# EAGLE design control_board (EAGLE 7.5.0)
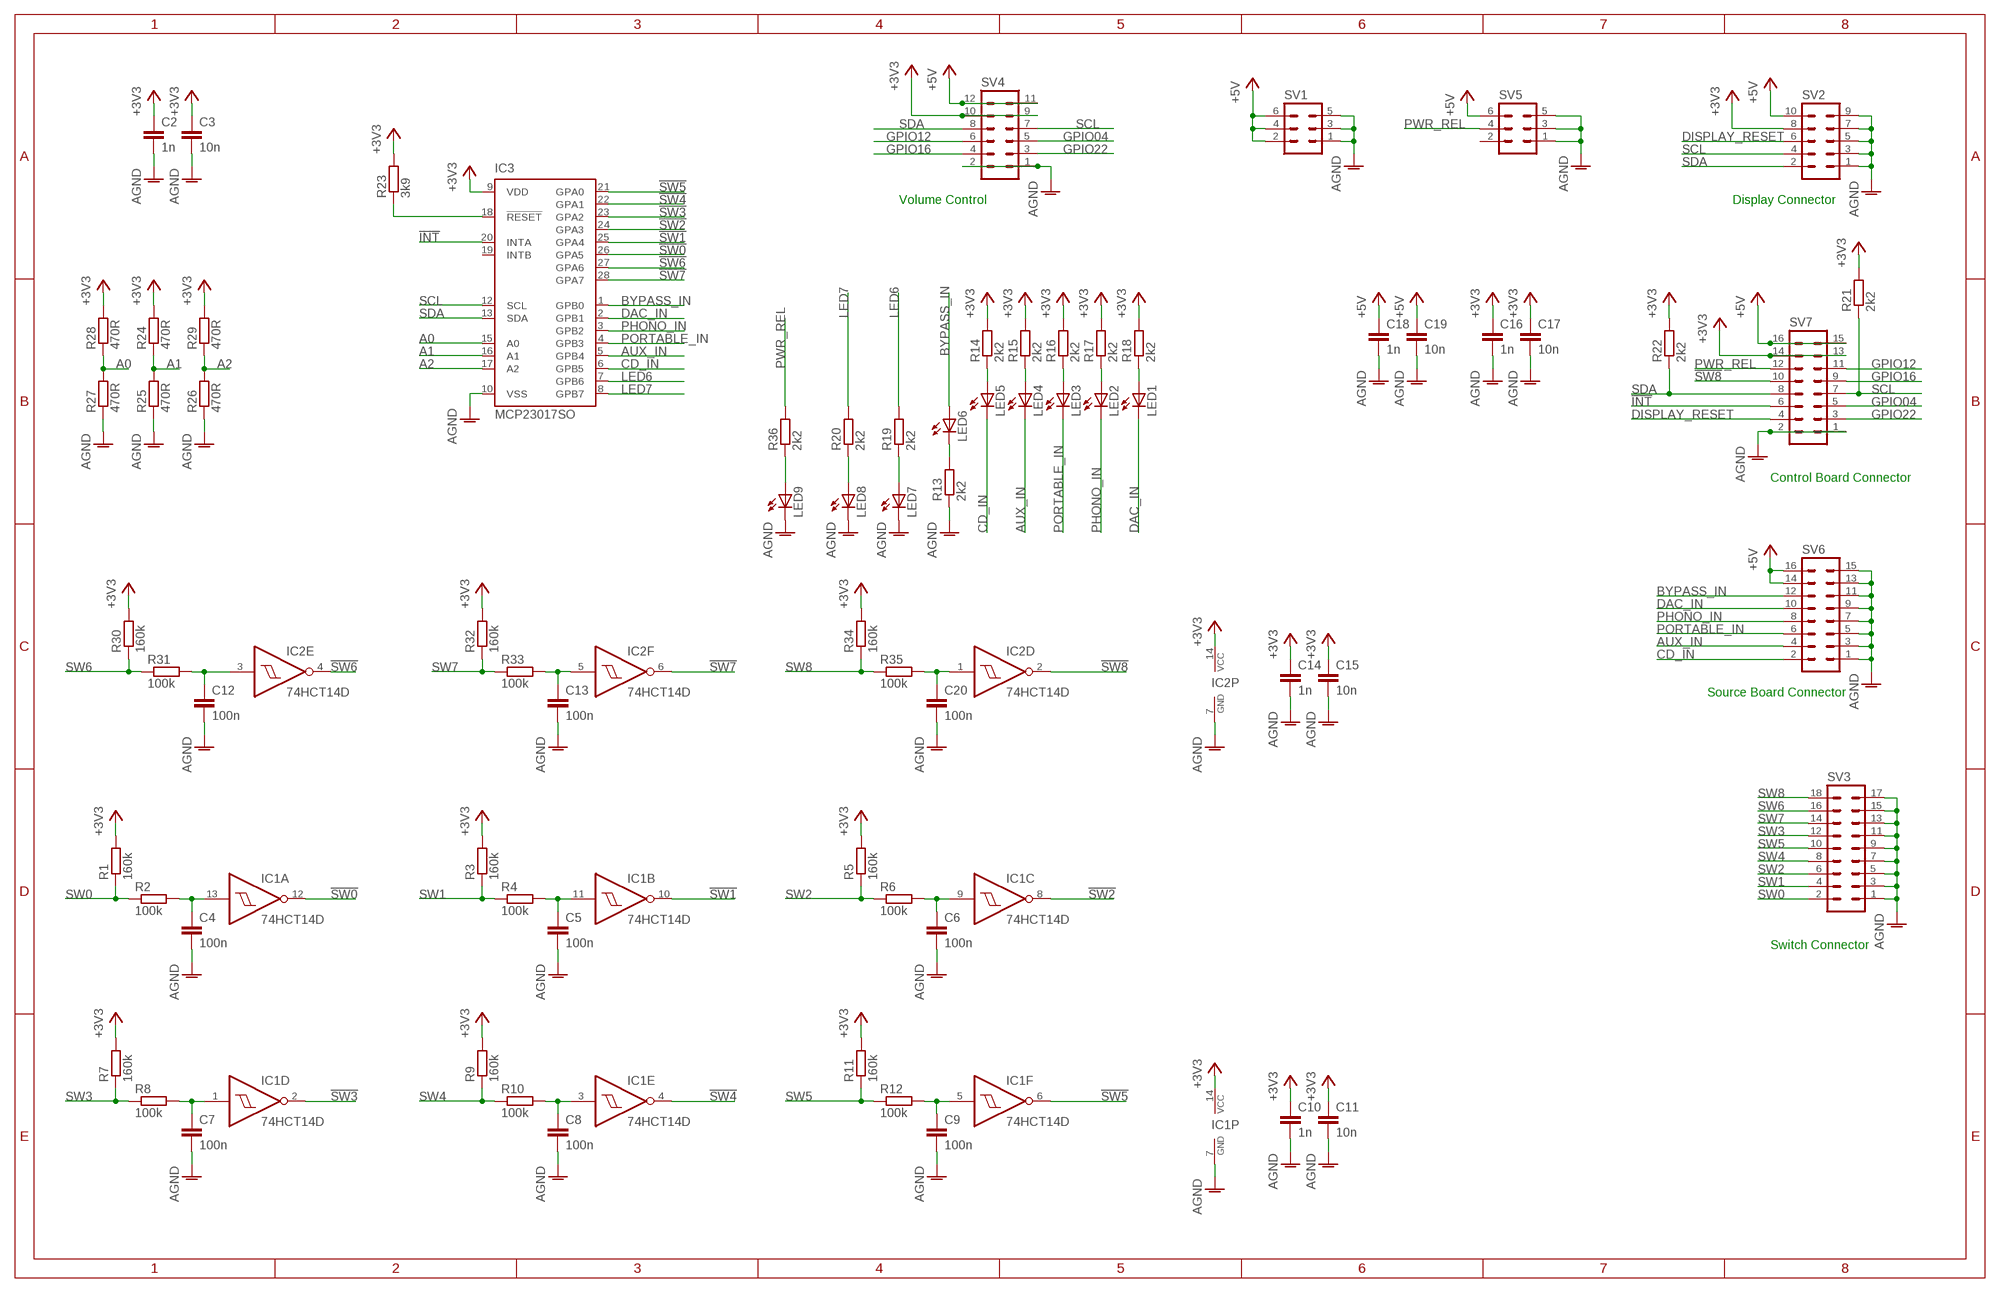
[diagram p0: schematic, sheet 1]

## Parts
C2  1n  C-EUC0603  [C0603]
C3  10n  C-EUC0603  [C0603]
C4  100n  C-EUC0603  [C0603]
C5  100n  C-EUC0603  [C0603]
C6  100n  C-EUC0603  [C0603]
C7  100n  C-EUC0603  [C0603]
C8  100n  C-EUC0603  [C0603]
C9  100n  C-EUC0603  [C0603]
C10  1n  C-EUC0603  [C0603]
C11  10n  C-EUC0603  [C0603]
C12  100n  C-EUC0603  [C0603]
C13  100n  C-EUC0603  [C0603]
C14  1n  C-EUC0603  [C0603]
C15  10n  C-EUC0603  [C0603]
C16  1n  C-EUC0603  [C0603]
C17  10n  C-EUC0603  [C0603]
C18  1n  C-EUC0603  [C0603]
C19  10n  C-EUC0603  [C0603]
C20  100n  C-EUC0603  [C0603]
IC1  74HCT14D  [SO14]
IC2  74HCT14D  [SO14]
IC3  MCP23017SO  [SO28W]
LED1  LEDCHIPLED_0603  [CHIPLED_0603]
LED2  LEDCHIPLED_0603  [CHIPLED_0603]
LED3  LEDCHIPLED_0603  [CHIPLED_0603]
LED4  LEDCHIPLED_0603  [CHIPLED_0603]
LED5  LEDCHIPLED_0603  [CHIPLED_0603]
LED6  LEDCHIPLED_0603  [CHIPLED_0603]
LED7  LEDCHIPLED_0603  [CHIPLED_0603]
LED8  LEDCHIPLED_0603  [CHIPLED_0603]
LED9  LEDCHIPLED_0603  [CHIPLED_0603]
R1  160k  R-EU_R0603  [R0603]
R2  100k  R-EU_R0603  [R0603]
R3  160k  R-EU_R0603  [R0603]
R4  100k  R-EU_R0603  [R0603]
R5  160k  R-EU_R0603  [R0603]
R6  100k  R-EU_R0603  [R0603]
R7  160k  R-EU_R0603  [R0603]
R8  100k  R-EU_R0603  [R0603]
R9  160k  R-EU_R0603  [R0603]
R10  100k  R-EU_R0603  [R0603]
R11  160k  R-EU_R0603  [R0603]
R12  100k  R-EU_R0603  [R0603]
R13  2k2  R-EU_R0603  [R0603]
R14  2k2  R-EU_R0603  [R0603]
R15  2k2  R-EU_R0603  [R0603]
R16  2k2  R-EU_R0603  [R0603]
R17  2k2  R-EU_R0603  [R0603]
R18  2k2  R-EU_R0603  [R0603]
R19  2k2  R-EU_R0603  [R0603]
R20  2k2  R-EU_R0603  [R0603]
R21  2k2  R-EU_R0603  [R0603]
R22  2k2  R-EU_R0603  [R0603]
R23  3k9  R-EU_R0603  [R0603]
R24  470R  R-EU_R0603  [R0603]
R25  470R  R-EU_R0603  [R0603]
R26  470R  R-EU_R0603  [R0603]
R27  470R  R-EU_R0603  [R0603]
R28  470R  R-EU_R0603  [R0603]
R29  470R  R-EU_R0603  [R0603]
R30  160k  R-EU_R0603  [R0603]
R31  100k  R-EU_R0603  [R0603]
R32  160k  R-EU_R0603  [R0603]
R33  100k  R-EU_R0603  [R0603]
R34  160k  R-EU_R0603  [R0603]
R35  100k  R-EU_R0603  [R0603]
R36  2k2  R-EU_R0603  [R0603]
SV1  MA03-2  [MA03-2]
SV2  MA05-2  [MA05-2]
SV3  MA09-2  [MA09-2]
SV4  MA06-2  [MA06-2]
SV5  MA03-2  [MA03-2]
SV6  MA08-2  [MA08-2]
SV7  MA08-2  [MA08-2]

## Nets
!INT: IC3.20(INTA) SV7.6
!SW0: IC1.12(A:O) IC3.26(GPA5)
!SW1: IC1.10(B:O) IC3.25(GPA4)
!SW2: IC1.8(C:O) IC3.24(GPA3)
!SW3: IC1.2(D:O) IC3.23(GPA2)
!SW4: IC1.4(E:O) IC3.22(GPA1)
!SW5: IC1.6(F:O) IC3.21(GPA0)
!SW6: IC2.4(E:O) IC3.27(GPA6)
!SW7: IC2.6(F:O) IC3.28(GPA7)
!SW8: IC2.2(D:O) SV7.10
+3V3: C2.1 C3.1 C10.1 C11.1 C14.1 C15.1 C16.1 C17.1 IC1.14(P:VCC) IC2.14(P:VCC) IC3.9(VDD) R1.2 R3.2 R5.2 R7.2 R9.2 R11.2 R14.2 R15.2 R16.2 R17.2 R18.2 R21.2 R22.2 R23.2 R24.2 R28.2 R29.2 R30.2 R32.2 R34.2 SV2.8 SV4.9 SV4.10 SV7.13 SV7.14
+5V: C18.1 C19.1 SV1.2 SV1.4 SV1.6 SV2.10 SV4.11 SV4.12 SV5.6 SV6.14 SV6.16 SV7.15 SV7.16
A0: IC3.15(A0) R27.2 R28.1
A1: IC3.16(A1) R24.1 R25.2
A2: IC3.17(A2) R26.2 R29.1
AGND: C2.2 C3.2 C4.2 C5.2 C6.2 C7.2 C8.2 C9.2 C10.2 C11.2 C12.2 C13.2 C14.2 C15.2 C16.2 C17.2 C18.2 C19.2 C20.2 IC1.7(P:GND) IC2.7(P:GND) IC3.10(VSS) LED7.C LED8.C LED9.C R13.1 R25.1 R26.1 R27.1 SV1.1 SV1.3 SV1.5 SV2.1 SV2.3 SV2.5 SV2.7 SV2.9 SV3.1 SV3.3 SV3.5 SV3.7 SV3.9 SV3.11 SV3.13 SV3.15 SV3.17 SV4.1 SV4.2 SV5.1 SV5.3 SV5.5 SV6.1 SV6.3 SV6.5 SV6.7 SV6.9 SV6.11 SV6.13 SV6.15 SV7.1 SV7.2
AUX_IN: IC3.5(GPB4) LED4.C SV6.4
BYPASS_IN: IC3.1(GPB0) LED6.A SV6.12
CD_IN: IC3.6(GPB5) LED5.C SV6.2
DAC_IN: IC3.2(GPB1) LED1.C SV6.10
DISPLAY_RESET: SV2.6 SV7.4
GPIO04: SV4.5 SV7.5
GPIO12: SV4.6 SV7.11
GPIO16: SV4.4 SV7.9
GPIO22: SV4.3 SV7.3
LED6: IC3.7(GPB6) R19.2
LED7: IC3.8(GPB7) R20.2
N$1: C20.1 IC2.1(D:I) R35.2
N$2: LED5.A R14.1
N$3: LED4.A R15.1
N$4: LED3.A R16.1
N$5: LED2.A R17.1
N$6: LED1.A R18.1
N$7: LED7.A R19.1
N$8: LED8.A R20.1
N$9: LED6.C R13.2
N$10: LED9.A R36.1
N$11: C12.1 IC2.3(E:I) R31.2
N$12: C4.1 IC1.13(A:I) R2.2
N$13: C13.1 IC2.5(F:I) R33.2
N$14: C5.1 IC1.11(B:I) R4.2
N$15: IC3.18(!RESET) R23.1
N$16: C6.1 IC1.9(C:I) R6.2
N$18: C7.1 IC1.1(D:I) R8.2
N$20: C8.1 IC1.3(E:I) R10.2
N$23: C9.1 IC1.5(F:I) R12.2
PHONO_IN: IC3.3(GPB2) LED2.C SV6.8
PORTABLE_IN: IC3.4(GPB3) LED3.C SV6.6
PWR_REL: R36.2 SV5.4 SV7.12
SCL: IC3.12(SCL) R21.1 SV2.4 SV4.7 SV7.7
SDA: IC3.13(SDA) R22.1 SV2.2 SV4.8 SV7.8
SW0: R1.1 R2.1 SV3.2
SW1: R3.1 R4.1 SV3.4
SW2: R5.1 R6.1 SV3.6
SW3: R7.1 R8.1 SV3.12
SW4: R9.1 R10.1 SV3.8
SW5: R11.1 R12.1 SV3.10
SW6: R30.1 R31.1 SV3.16
SW7: R32.1 R33.1 SV3.14
SW8: R34.1 R35.1 SV3.18
Unconnected: IC2.8(C:O) IC2.9(C:I) IC2.10(B:O) IC2.11(B:I) IC2.12(A:O) IC2.13(A:I) IC3.19(INTB) SV5.2

## Notes on the sheet
- Volume Control | Display Connector
- Control Board Connector
- Source Board Connector
- Switch Connector

## Library data of the parts
C2-C20 = rcl:C-EU: CAPACITOR, European symbol
IC1 IC2 = 74xx-eu:74*14: Hex schmitt trigger INVERTER
IC3 = microchip:MCP23017: http://ww1.microchip.com/downloads/en/DeviceDoc/21952a.pdf Source: http://ww1.microchip.com/downloads/en/DeviceDoc/21952a.pdf; MF: MICROCHIP; MPN: MCP23017-E/SO; OC_FARNELL: 1332087; OC_NEWARK: 31K2958
LED1-LED9 = led:LED: LED OSRAM: - CHIPLED LG R971, LG N971, LY N971, LG Q971, LY Q971, LO R971, LY R971 LH N974, LH R974 LS Q976, LO Q976, LY Q976 LO Q996 - Hyper CHIPLED LW Q18S LB Q993, LB Q99A, LB R99A - SideLED LS A670, LO A670, LY A670, LG A670, LP A670 LB A673, LV A673, LT A673, LW A673 LH A674 LY A675 LS A676, LA A676, LO A676, LY A676, LW A676 LS A679, LY A679, LG A679 - Hyper Micro SIDELED® LS Y876, LA Y876, LO Y876, LY Y876 LT Y87S - SmartLED LW L88C, LW L88S LB L89C, LB L89S, LG L890 LS L89K, LO L89K, LY L89K LS L896, LA L896, LO L896, LY L896 - TOPLED LS T670, LO T670, LY T670, LG T670, LP T670 LSG T670, LSP T670, LSY T670, LOP T670, LYG T670 LG T671, LOG T671, LSG T671 LB T673, LV T673, LT T673, LW T673 LH T674 LS T676, LA T676, LO T676, LY T676, LB T676, LH T676, LSB T676, LW T676 LB T67C, LV T67C, LT T67C, LS T67K, LO T67K, LY T67K, LW E67C LS E67B, LA E67B, LO E67B, LY E67B, LB E67C, LV E67C, LT E67C LW T67C LS T679, LY T679, LG T679 LS T770, LO T770, LY T770, LG T770, LP T770 LB T773, LV T773, LT T773, LW T773 LH T774 LS E675, LA E675, LY E675, LS T675 LS T776, LA T776, LO T776, LY T776, LB T776 LHGB T686 LT T68C, LB T68C - Hyper Mini TOPLED® LB M676 - Mini TOPLED Santana® LG M470 LS M47K, LO M47K, LY M47K Source: http://www.osram.convergy.de LUXEON: - LUMILED® LXK2-PW12-R00, LXK2-PW12-S00, LXK2-PW14-U00, LXK2-PW14-V00 LXK2-PM12-R00, LXK2-PM12-S00, LXK2-PM14-U00 LXK2-PE12-Q00, LXK2-PE12-R00, LXK2-PE12-S00, LXK2-PE14-T00, LXK2-PE14-U00 LXK2-PB12-K00, LXK2-PB12-L00, LXK2-PB12-M00, LXK2-PB14-N00, LXK2-PB14-P00, LXK2-PB14-Q00 LXK2-PR12-L00, LXK2-PR12-M00, LXK2-PR14-Q00, LXK2-PR14-R00 LXK2-PD12-Q00, LXK2-PD12-R00, LXK2-PD12-S00 LXK2-PH12-R00, LXK2-PH12-S00 LXK2-PL12-P00, LXK2-PL12-Q00, LXK2-PL12-R00 Source: www.luxeon.com KINGBRIGHT: KA-3528ASYC Source: www.kingbright.com
R1-R36 = rcl:R-EU_: RESISTOR, European symbol
SV1 SV5 = con-lstb:MA03-2: PIN HEADER; OC_FARNELL: unknown; OC_NEWARK: unknown
SV2 = con-lstb:MA05-2: PIN HEADER; OC_FARNELL: unknown; OC_NEWARK: unknown
SV3 = con-lstb:MA09-2: PIN HEADER; OC_FARNELL: unknown; OC_NEWARK: unknown
SV4 = con-lstb:MA06-2: PIN HEADER; OC_FARNELL: unknown; OC_NEWARK: unknown
SV6 SV7 = con-lstb:MA08-2: PIN HEADER; OC_FARNELL: unknown; OC_NEWARK: unknown

## Board
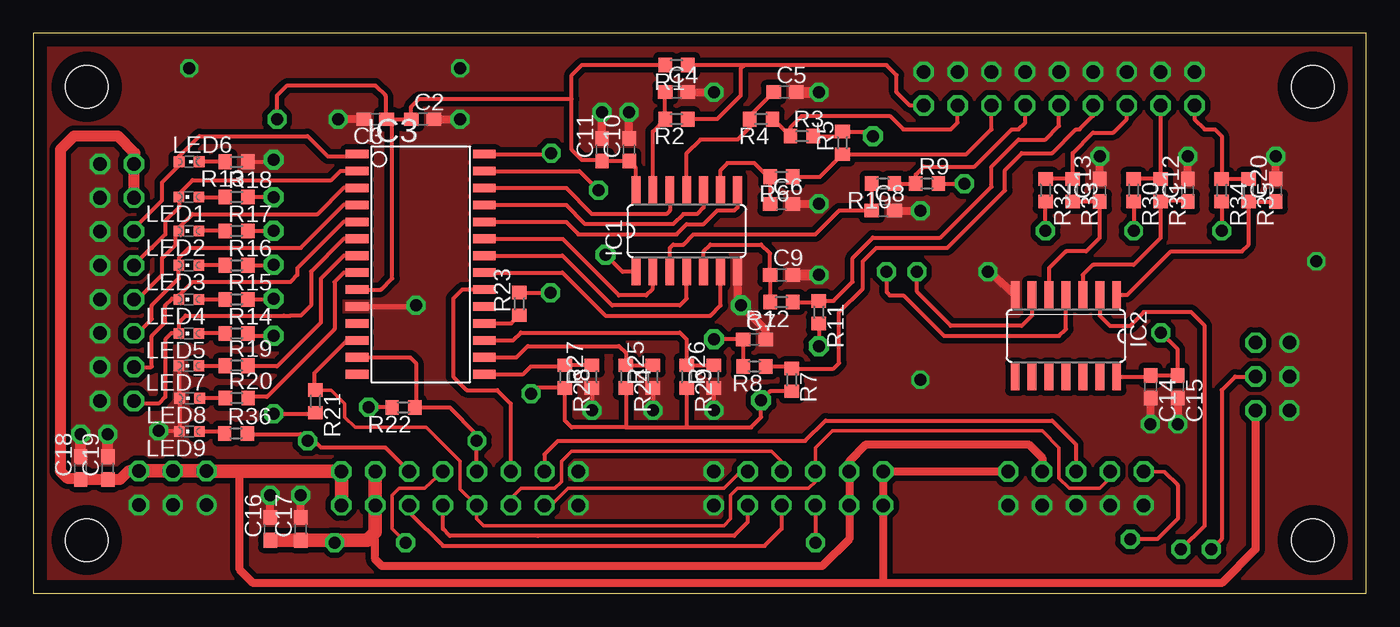
[diagram p1: board, top side]
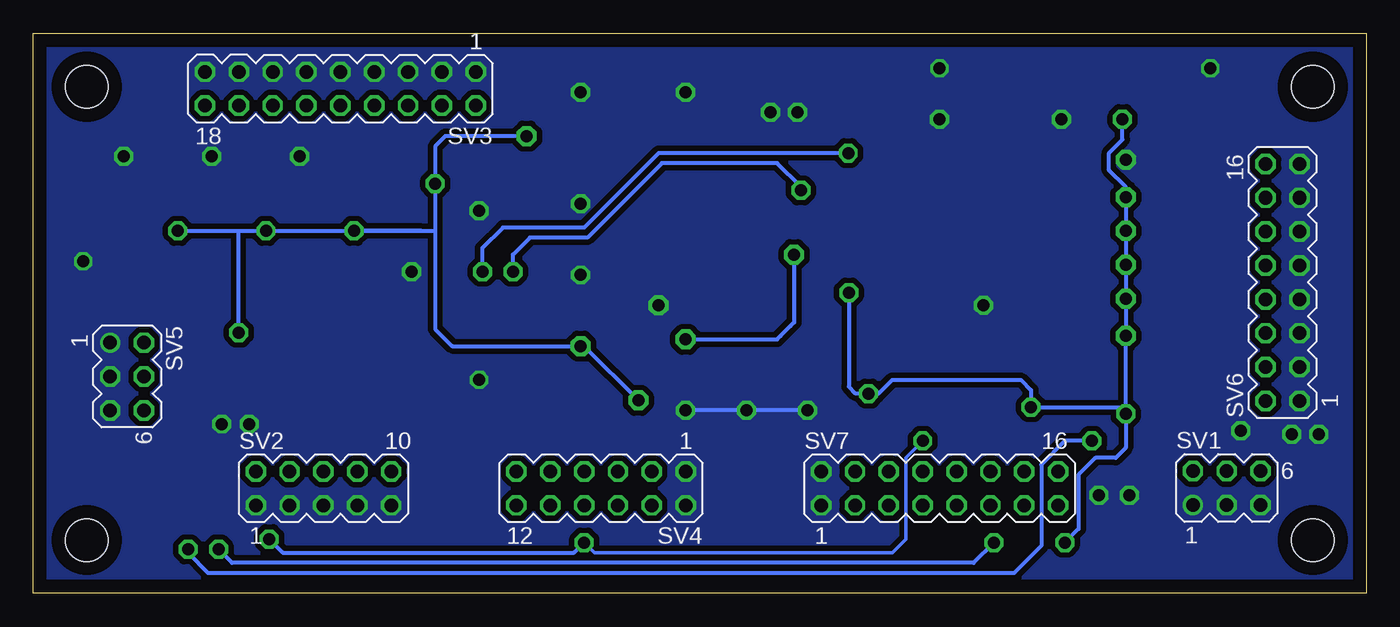
[diagram p2: board, bottom side, seen from below]

Size 100 x 42 mm. Coordinates in mm from the lower left corner, seen from the top.
Outline: 0,0 100,0 100,42 0,42 0,0
Copper layers (1*16): Top 0.035mm / dielectric 1.5mm / Bottom 0.035mm
Design rules "default": minimum track width 10mil, minimum drill 24mil, track to track 8mil, track to pad 8mil, pad to pad 8mil, via to via 8mil, smd to smd 8mil, copper to edge 40mil, drill to drill 8mil, minimum pad ring 10mil, minimum via ring 8mil, stop-mask expansion 4mil, vias tented up to drill 0mil, thermal gap 10mil
Holes 3.2 mm at 4,4 4,38 96,4 96,38

### Footprints (pad centres in the part's own frame; a part is rotated, then mirrored left to right if it is on the bottom)
C0603 = smd 1.1 x 1: 1 -0.85,0; 2 0.85,0
SO14 = smd 0.66 x 2.032: 1 -3.81,-3.073; 2 -2.54,-3.073; 3 -1.27,-3.073; 4 0,-3.073; 5 1.27,-3.073; 6 2.54,-3.073; 7 3.81,-3.073; 8 3.81,3.073; 9 2.54,3.073; 10 1.27,3.073; 11 0,3.073; 12 -1.27,3.073; 13 -2.54,3.073; 14 -3.81,3.073
SO28W = smd 0.65 x 1.7: 1 -7.62,-4.78; 2 -6.35,-4.78; 3 -5.08,-4.78; 4 -3.81,-4.78; 5 -2.54,-4.78; 6 -1.27,-4.78; 7 0,-4.78; 8 1.27,-4.78; 9 2.54,-4.78; 10 3.81,-4.78; 11 5.08,-4.78; 12 6.35,-4.78; 13 7.62,-4.78; 14 8.89,-4.78; 15 8.89,4.78; 16 7.62,4.78; 17 6.35,4.78; 18 5.08,4.78; 19 3.81,4.78; 20 2.54,4.78; 21 1.27,4.78; 22 0,4.78; 23 -1.27,4.78; 24 -2.54,4.78; 25 -3.81,4.78; 26 -5.08,4.78; 27 -6.35,4.78; 28 -7.62,4.78
CHIPLED_0603 = smd 0.8 x 0.8: A 0,-0.75; C 0,0.75
R0603 = smd 1 x 1.1: 1 -0.85,0; 2 0.85,0
MA03-2 = drill 1.016: 1 -2.54,-1.27 | drill 1.016 octagon: 2 -2.54,1.27; 3 0,-1.27; 4 0,1.27; 5 2.54,-1.27; 6 2.54,1.27
MA05-2 = drill 1.016 octagon: 1 -5.08,-1.27; 2 -5.08,1.27; 3 -2.54,-1.27; 4 -2.54,1.27; 5 0,-1.27; 6 0,1.27; 7 2.54,-1.27; 8 2.54,1.27; 9 5.08,-1.27; 10 5.08,1.27
MA09-2 = drill 1.016 octagon: 1 -10.16,-1.27; 2 -10.16,1.27; 3 -7.62,-1.27; 4 -7.62,1.27; 5 -5.08,-1.27; 6 -5.08,1.27; 7 -2.54,-1.27; 8 -2.54,1.27; 9 0,-1.27; 10 0,1.27; 11 2.54,-1.27; 12 2.54,1.27; 13 5.08,-1.27; 14 5.08,1.27; 15 7.62,-1.27; 16 7.62,1.27; 17 10.16,-1.27; 18 10.16,1.27
MA06-2 = drill 1.016 octagon: 1 -6.35,-1.27; 2 -6.35,1.27; 3 -3.81,-1.27; 4 -3.81,1.27; 5 -1.27,-1.27; 6 -1.27,1.27; 7 1.27,-1.27; 8 1.27,1.27; 9 3.81,-1.27; 10 3.81,1.27; 11 6.35,-1.27; 12 6.35,1.27
MA08-2 = drill 1.016 octagon: 1 -8.89,-1.27; 2 -8.89,1.27; 3 -6.35,-1.27; 4 -6.35,1.27; 5 -3.81,-1.27; 6 -3.81,1.27; 7 -1.27,-1.27; 8 -1.27,1.27; 9 1.27,-1.27; 10 1.27,1.27; 11 3.81,-1.27; 12 3.81,1.27; 13 6.35,-1.27; 14 6.35,1.27; 15 8.89,-1.27; 16 8.89,1.27

### Placement (x,y rotation side)
C2  29.21,35.56 0 top
C3  25.65,35.56 180 top
C4  48.26,37.59 0 top
C5  56.39,37.59 0 top
C6  56.13,29.21 0 top
C7  54.1,19.05 0 top
C8  63.75,28.7 0 top
C9  56.13,23.88 0 top
C10  44.7,33.27 90 top
C11  42.67,33.27 90 top
C12  86.61,30.23 90 top
C13  80.01,30.23 90 top
C14  83.82,15.49 270 top
C15  85.85,15.49 270 top
C16  17.78,4.83 90 top
C17  20.07,4.83 90 top
C18  3.56,9.4 90 top
C19  5.59,9.4 90 top
C20  93.22,30.23 90 top
IC1  49.02,27.18 0 top
IC2  77.47,19.3 180 top
IC3  29.07,25.32 270 top
LED1  11.68,29.73 90 top
LED2  11.68,27.18 90 top
LED3  11.68,24.61 90 top
LED4  11.68,22.05 90 top
LED5  11.68,19.49 90 top
LED6  11.69,32.37 270 top
LED7  11.68,17.07 90 top
LED8  11.73,14.63 90 top
LED9  11.71,12.14 90 top
R1  48.26,39.62 180 top
R2  48.26,35.56 180 top
R3  57.66,34.29 0 top
R4  54.61,35.56 180 top
R5  60.71,33.78 90 top
R6  56.13,31.24 180 top
R7  56.9,16 270 top
R8  54.1,17.02 180 top
R9  67.06,30.73 0 top
R10  63.75,30.73 180 top
R11  58.93,21.08 270 top
R12  56.13,21.84 180 top
R13  15.24,32.37 180 top
R14  15.24,19.49 0 top
R15  15.24,22.05 0 top
R16  15.24,24.61 0 top
R17  15.24,27.18 0 top
R18  15.24,29.73 0 top
R19  15.24,17.07 0 top
R20  15.27,14.64 0 top
R21  21.16,14.39 270 top
R22  27.76,13.94 180 top
R23  36.47,21.7 90 top
R24  44.45,16.26 270 top
R25  46.48,16.26 90 top
R26  51.05,16.26 90 top
R27  41.91,16.26 90 top
R28  39.88,16.26 270 top
R29  49.02,16.26 270 top
R30  82.55,30.23 270 top
R31  84.58,30.23 270 top
R32  75.95,30.23 270 top
R33  77.98,30.23 270 top
R34  89.15,30.23 270 top
R35  91.19,30.23 270 top
R36  15.21,11.99 0 top
SV1  10.46,7.91 0 bottom
SV2  78.23,7.87 0 bottom
SV3  76.96,37.85 180 bottom
SV4  57.4,7.87 180 bottom
SV5  92.96,16.26 270 bottom
SV6  6.27,23.32 90 bottom
SV7  32,7.87 0 bottom

### Tracks (layer width: path | path; a pad name or v marks a point on that pad's centre or on a via)
!INT
  Top 0.305: IC3.20 32.18,22.78 31.5,22.1 31.5,16.26 32.51,15.24 34.8,15.24 35.81,14.22 SV7.6
!SW0
  Top 0.305: IC1.12 47.75,28.7 47.5,28.45 41.91,28.45 39.96,30.4 IC3.26
!SW1
  Top 0.305: IC1.10 50.29,28.96 49.78,28.45 48.77,28.45 48.01,27.69 41.4,27.69 39.96,29.13 IC3.25
!SW2
  Top 0.305: IC1.8 52.83,28.96 52.58,28.7 51.31,28.7 50.29,27.69 49.02,27.69 48.26,26.92 40.89,26.92 39.96,27.86 IC3.24
!SW3
  Top 0.305: IC1.2 46.48,22.86 45.97,22.35 43.94,22.35 39.7,26.59 IC3.23
!SW4
  Top 0.305: IC1.4 49.02,22.1 48.51,21.59 43.43,21.59 39.7,25.32 IC3.22
!SW5
  Top 0.305: IC1.6 51.56,21.59 50.8,20.83 42.93,20.83 39.7,24.05 IC3.21
!SW6  (via drill 0.9 pad 1.42)
  Top 0.305: IC3.27 40.97,31.67 v42.42,30.23 | IC2.4 77.47,19.81 76.96,19.3 68.33,19.3 65.28,22.35 64.26,22.35 64.01,22.61 v64.01,24.13
  Bottom 0.305: v42.42,30.23 42.42,30.48 44.2,32.26 52.83,32.26 58.42,26.67 62.74,26.67 64.01,25.4 v64.01,24.13
!SW7  (via drill 0.9 pad 1.42)
  Top 0.305: IC3.28 38.78,32.94 v38.86,33.02 | v66.29,24.13 66.29,22.61 68.83,20.07 74.17,20.07 74.93,20.83 IC2.6
  Bottom 0.305: v38.86,33.02 53.09,33.02 58.67,27.43 64.77,27.43 66.29,25.91 v66.29,24.13
!SW8  (via drill 0.9 pad 1.42)
  Top 0.254: v27.94,3.81 26.92,4.83 26.92,7.37 27.43,7.87 29.34,7.87 SV7.10
  Top 0.305: IC2.2 80.01,20.83 80.77,20.07 82.3,20.07 83.31,21.08 86.87,21.08 87.88,20.07 87.88,5.08 v86.11,3.3
  Bottom 0.305: v27.94,3.81 29.46,2.29 85.09,2.29 v86.11,3.3
+3V3  (via drill 0.9 pad 1.42, 0.9 pad 1.5)
  Top 0.305: R15.2 17.99,22.05 v18.03,22.1 | R14.2 16.28,19.3 v18.03,19.3 | R16.2 18,24.61 v18.03,24.64 | R17.2 v18.03,27.18 | R18.2 18.02,29.73 v18.03,29.72 | C3.1 C2.1 28.36,36.49 28.96,37.08 40.39,37.08 | IC1.14 45.21,31.92 C10.1 C11.1 42.58,32.51 41.15,32.51 40.39,33.27 40.39,37.08 | IC3.9 26.08,22.78 26.92,23.62 26.92,35.14 C3.1 | R23.2 v38.81,22.55 38.86,22.61 | v18.03,13.46 21.09,13.46 R21.2 | 49.02,13.21 R29.2 49.02,12.45 | R24.2 44.45,12.45 | 44.45,12.45 40.39,12.45 39.88,12.95 R28.2 37.76,15.41 v37.34,14.99 | R22.2 25.18,13.94 v25.15,13.97 | 44.45,12.45 49.02,12.45 | 49.02,12.45 53.85,12.45 54.61,13.21 v54.61,14.48 55.28,15.15 R7.2 | v18.29,35.56 18.29,37.34 19.05,38.1 25.65,38.1 26.42,37.34 26.42,35.65 C3.1 | R1.2 41.15,39.62 40.39,38.86 40.39,37.08 | R3.2 60.36,34.29 R5.2 62.65,34.63 v62.99,34.29 | R9.2 v69.85,30.73 | R11.2 v58.93,18.54 | v75.95,27.18 R32.2 | R30.2 v82.55,27.18 | R34.2 v89.15,27.18 | IC2.14 83.71,16.23 C14.1 C15.1 85.85,18.29 v84.58,19.56
  Top 0.61: 25.65,4.57 25.65,2.54 26.16,2.03 59.18,2.03 61.21,4.06 SV4.10 SV4.9 61.21,9.91 62.48,11.18 74.68,11.18 75.69,10.16 SV2.8
  Top 1.016: SV7.14 SV7.13 25.65,4.57 25.06,3.98 22.77,3.98 | C16.1 C17.1 22.77,3.98 | 22.77,3.98 v22.61,3.81
  Bottom 0.305: 18.03,13.97 v18.03,13.46 18.03,10.92 18.8,10.16 20.32,10.16 21.59,8.89 21.59,4.83 v22.61,3.81 | 18.03,13.97 v18.03,19.3 v18.03,22.1 v18.03,24.64 v18.03,27.18 v18.03,29.72 18.03,30.48 19.3,31.75 19.3,33.02 18.29,34.04 v18.29,35.56 | 18.03,13.97 v25.15,13.97 25.15,15.24 25.91,16 35.56,16 36.58,14.99 v37.34,14.99 38.3,14.99 38.81,15.49 v38.81,22.55 | v62.99,34.29 69.09,34.29 69.85,33.53 v69.85,30.73 69.85,27.18 | 70.87,27.18 v75.95,27.18 | v54.61,14.48 58.67,18.54 v58.93,18.54 68.58,18.54 69.85,19.81 69.85,27.18 | v75.95,27.18 69.85,27.18 | v75.95,27.18 v82.55,27.18 84.58,27.18 | v89.15,27.18 84.58,27.18 | v84.58,19.56 84.58,27.18
+5V
  Top 0.61: 63.75,0.76 89.15,0.76 91.69,3.3 SV5.6 | 63.75,0.76 16.51,0.76 15.49,1.78 15.49,9.14 | 73.21,9.14 SV2.10 SV4.11 SV4.12 63.75,0.76
  Top 0.813: SV1.6 7.14,9.18 6.52,8.55 C19.1 C18.1 3.47,8.64 2.54,8.64 2.03,9.14 2.03,33.27 3.05,34.29 6.35,34.29 7.62,33.02 7.62,32.26 7.57,32.21 SV6.16 SV6.14
  Top 1.016: SV1.6 SV1.4 SV1.2 13.03,9.14 15.49,9.14 SV7.16 SV7.15
A0
  Top 0.305: R27.2 R28.1 39.79,17.02 37.34,17.02 36.75,16.43 IC3.15
A1
  Top 0.305: IC3.16 36.24,17.7 37.08,18.54 43.94,18.54 44.45,18.03 R24.1 R25.2
A2
  Top 0.305: IC3.17 35.99,18.97 36.58,19.56 48.51,19.56 49.02,19.05 R29.1 R26.2
AGND  (via drill 0.9, 0.9 pad 1.42, 0.9 pad 1.5)
  Top 0.305: R27.1 v41.91,13.72 | v51.05,13.72 R26.1 | R25.1 v46.48,13.72 46.48,13.46 | R13.1 17.89,32.37 v18.03,32.51 | LED7.C 10.93,14.68 LED8.C 10.98,12.16 LED9.C 9.45,12.14 v9.4,12.19
  Top 0.406: IC3.10 28.62,21.51 v28.7,21.59
  Top 0.61: C3.2 v22.86,35.56 | C2.2 v32,35.56 | C11.2 v42.67,36.07 | C10.2 v44.7,36.07 | C6.2 v58.93,29.21 | IC1.7 52.83,21.84 v53.09,21.59 54.95,19.72 C7.2 | C16.2 v17.78,7.37 | C17.2 v20.07,7.37 | C4.2 v51.05,37.59 | C8.2 v66.55,28.7 | C13.2 v80.01,32.77 | C12.2 v86.61,32.77 | C20.2 v93.22,32.77 | C15.2 v85.85,12.7 | C14.2 v83.82,12.7 | IC2.7 71.65,24.16 v71.63,24.13
  Top 0.813: C9.2 v58.93,23.88 | C19.2 v5.59,11.94 | C18.2 v3.56,11.94 | C5.2 v58.93,37.59
  Bottom 0.305: v51.05,13.72 v46.48,13.72 v41.91,13.72
  other vias: 11.68,39.37 32,39.37 66.55,16 96.27,24.89
  pour Bottom (isolate 0.406, no thermals): 0,41.91 100.33,41.91 100.33,0 0,0
  pour Top (isolate 0.406, no thermals): 0,0 100.08,0 100.08,41.91 0,41.91
AUX_IN
  Top 0.305: SV6.4 8.84,16.97 8.89,17.02 8.89,19.3 9.91,20.32 9.91,21.59 10.41,22.1 10.89,22.1 LED4.C 10.93,22.36 11.94,23.37 19.3,23.37 19.81,23.88 19.81,24.38 23.29,27.86 IC3.5
BYPASS_IN
  Top 0.305: SV6.12 7.54,27.35 9.65,29.46 9.65,30.82 10.94,32.11 LED6.A 10.94,32.78 12.45,34.29 20.57,34.29 22.1,32.77 24.11,32.77 IC3.1
CD_IN
  Top 0.305: SV6.2 7.74,14.22 9.4,14.22 9.91,14.73 9.91,19.05 10.35,19.49 LED5.C 10.93,20.33 11.43,20.83 18.8,20.83 19.3,20.83 20.07,20.83 20.83,21.59 20.83,24.13 23.29,26.59 IC3.6
DAC_IN
  Top 0.305: SV6.10 8.86,25.91 8.89,25.91 9.91,26.92 9.91,27.94 10.93,28.97 LED1.C 10.93,29.98 11.94,30.99 22.35,30.99 23.04,31.67 IC3.2
DISPLAY_RESET
  Top 0.305: SV2.6 78.23,11.18 76.58,12.83 76.45,12.95 59.44,12.95 57.91,11.43 39.37,11.43 38.35,10.41 SV7.4
GPIO04
  Top 0.254: SV7.5 35.81,7.11 36.58,7.87 39.12,7.87 39.62,8.38 39.62,9.91 40.39,10.67 55.37,10.67 56.13,9.91 SV4.5
GPIO12
  Top 0.305: SV4.6 56.13,4.83 54.86,3.56 30.73,3.56 28.19,6.1 SV7.11
GPIO16
  Top 0.254: 37.85,4.32 39.12,4.32
  Top 0.305: SV7.9 30.73,4.83 31.24,4.32 37.85,4.32 52.58,4.32 53.59,5.33 SV4.4
GPIO22
  Top 0.254: SV4.3 53.09,9.14 51.82,7.87 40.13,7.87 38.86,6.6 SV7.3
LED6
  Top 0.305: IC3.7 23.29,25.32 21.59,23.62 21.59,20.32 18.29,17.02 16.14,17.02 R19.2
LED7
  Top 0.305: IC3.8 23.29,24.05 22.61,23.37 22.61,19.81 17.53,14.73 16.2,14.73 R20.2
N$1
  Top 0.305: C20.1 R35.2 91.19,26.16 90.68,25.65 85.34,25.65 82.07,22.38 IC2.1
N$2
  Top 0.305: R14.1 LED5.A
N$3
  Top 0.305: LED4.A R15.1
N$4
  Top 0.305: R16.1 LED3.A
N$5
  Top 0.305: R17.1 LED2.A
N$6
  Top 0.305: LED1.A 12.68,29.73 12.7,29.72 14.37,29.72 R18.1
N$7
  Top 0.305: LED7.A R19.1
N$8
  Top 0.305: R20.1 12.49,14.64 LED8.A
N$9
  Top 0.305: R13.2 LED6.C
N$10
  Top 0.305: LED9.A 14.21,12.14 R36.1
N$11
  Top 0.305: 84.84,29.12 R31.2 | R31.2 85,29.38 85.09,29.46 86.53,29.46 C12.1 | R31.2 84.58,26.67 82.55,24.64 79.5,24.64 78.74,23.88 IC2.3
N$12
  Top 0.305: IC1.13 46.48,34.63 R2.2 C4.1
N$13
  Top 0.305: R33.2 C13.1 80.01,26.67 78.99,25.65 77.47,25.65 76.2,24.38 IC2.5
N$14
  Top 0.305: IC1.11 49.02,33.02 50.04,34.04 52.83,34.04 53.76,34.96 R4.2 53.76,35.81 C5.1
N$15
  Top 0.305: IC3.18 35.85,20.24 R23.1
N$16
  Top 0.305: IC1.9 51.56,31.75 52.07,32.26 54.1,32.26 55.12,31.24 R6.2 C6.1
N$18  (via drill 0.9 pad 1.5)
  Top 0.305: v51.05,19.05 C7.1 R8.2 | IC1.1 44.22,24.11 v42.93,25.4
  Bottom 0.305: v51.05,19.05 44.2,19.05 43.94,19.3 43.18,20.07 42.93,20.32 v42.93,25.4
N$20
  Top 0.305: IC1.3 47.75,25.91 48.01,26.16 48.77,26.16 49.53,26.92 58.67,26.92 60.45,28.7 C8.1 R10.2
N$23
  Top 0.305: IC1.5 50.29,25.65 50.8,26.16 54.61,26.16 55.28,25.49 C9.1 R12.2
PHONO_IN
  Top 0.305: SV6.8 7.82,22.05 9.65,23.88 9.65,25.15 10.67,26.16 10.67,26.91 LED2.C 10.93,27.44 11.94,28.45 21.34,28.45 23.29,30.4 IC3.3
PORTABLE_IN
  Top 0.305: SV6.6 7.82,19.51 8.89,20.57 8.89,21.59 10.92,23.62 10.92,24.59 LED3.C 10.93,25.16 11.68,25.91 20.07,25.91 23.29,29.13 IC3.4
PWR_REL  (via drill 0.9 pad 1.42)
  Top 0.305: R36.2 16.11,11.94 20.07,11.94 v20.57,11.43 21.08,11.43 21.59,10.92 26.42,10.92 SV7.12 | SV5.4 90.17,16.26 89.15,15.24 89.15,4.06 v88.39,3.3
  Bottom 0.305: v20.57,11.43 22.61,11.43 24.38,9.65 24.38,3.56 26.42,1.52 86.87,1.52 88.39,3.05 v88.39,3.3
SCL
  Top 0.254: R21.1 22.35,15.24 23.37,14.22 23.37,13.21 24.13,12.45 29.46,12.45 32,9.91 32,7.81 SV7.7 33.27,5.59 33.78,5.08 51.82,5.08 52.32,5.59 52.32,7.37 52.83,7.87 58.17,7.87 58.67,8.38 SV4.7 58.67,10.92 59.94,12.19 75.69,12.19 76.96,10.92 76.96,8.64 77.72,7.87 80.01,7.87 80.77,8.64 SV2.4
  Top 0.305: IC3.12 23.54,18.97 21.08,16.51 21.08,15.32 R21.1
SDA  (via drill 0.9 pad 1.42)
  Top 0.305: SV4.8 v58.67,3.81 | IC3.13 28.27,17.7 28.7,17.27 28.7,14.03 R22.1 31.24,13.94 33.27,11.91 v33.27,11.43 SV7.8 | SV2.2 84.87,9.11 85.85,8.13 85.85,5.59 84.33,4.06 v82.3,4.06
  Bottom 0.254: v33.27,11.43 34.54,10.16 34.54,4.06 35.56,3.05 57.91,3.05 v58.67,3.81
  Bottom 0.305: v82.3,4.06 81.28,3.05 59.44,3.05 v58.67,3.81
SW0
  Top 0.305: SV3.2 65.79,36.58 64.77,37.59 64.77,38.86 64.01,39.62 53.34,39.62 | 53.34,39.62 R1.1 | R2.1 51.31,35.56 53.09,37.34 53.09,39.37 53.34,39.62
SW1
  Top 0.305: R4.1 55.54,35.56 R3.1 56.81,34.96 57.66,35.81 64.26,35.81 65.28,34.8 68.83,34.8 69.34,35.31 SV3.4
SW2
  Top 0.305: R6.1 59.02,31.24 R5.1 70.02,32.93 71.88,34.8 SV3.6
SW3
  Top 0.305: R8.1 56.73,17.02 R7.1 60.03,16.85 60.45,17.27 60.45,21.08 62.23,22.86 62.23,24.89 63.25,25.91 68.58,25.91 72.9,30.23 72.9,31.75 74.17,33.02 76.45,33.02 78.23,34.8 78.49,34.8 79.5,35.81 SV3.12
SW4
  Top 0.305: SV3.8 74.42,35.31 73.91,34.8 73.41,34.8 70.61,32 66.8,32 66.21,31.41 R9.1 R10.1
SW5
  Top 0.305: R12.1 58.84,21.84 R11.1 60.03,21.93 61.47,23.37 61.47,25.15 62.99,26.67 68.07,26.67 71.88,30.48 71.88,32 73.91,34.04 75.95,34.04 76.96,35.05 SV3.10
SW6
  Top 0.305: R30.1 R31.1 SV3.16
SW7
  Top 0.305: R32.1 R33.1 77.98,33.02 79.5,34.54 81.03,34.54 82.04,35.56 SV3.14
SW8
  Top 0.305: SV3.18 87.12,35.56 87.88,34.8 88.65,34.8 89.15,34.29 R34.1 R35.1